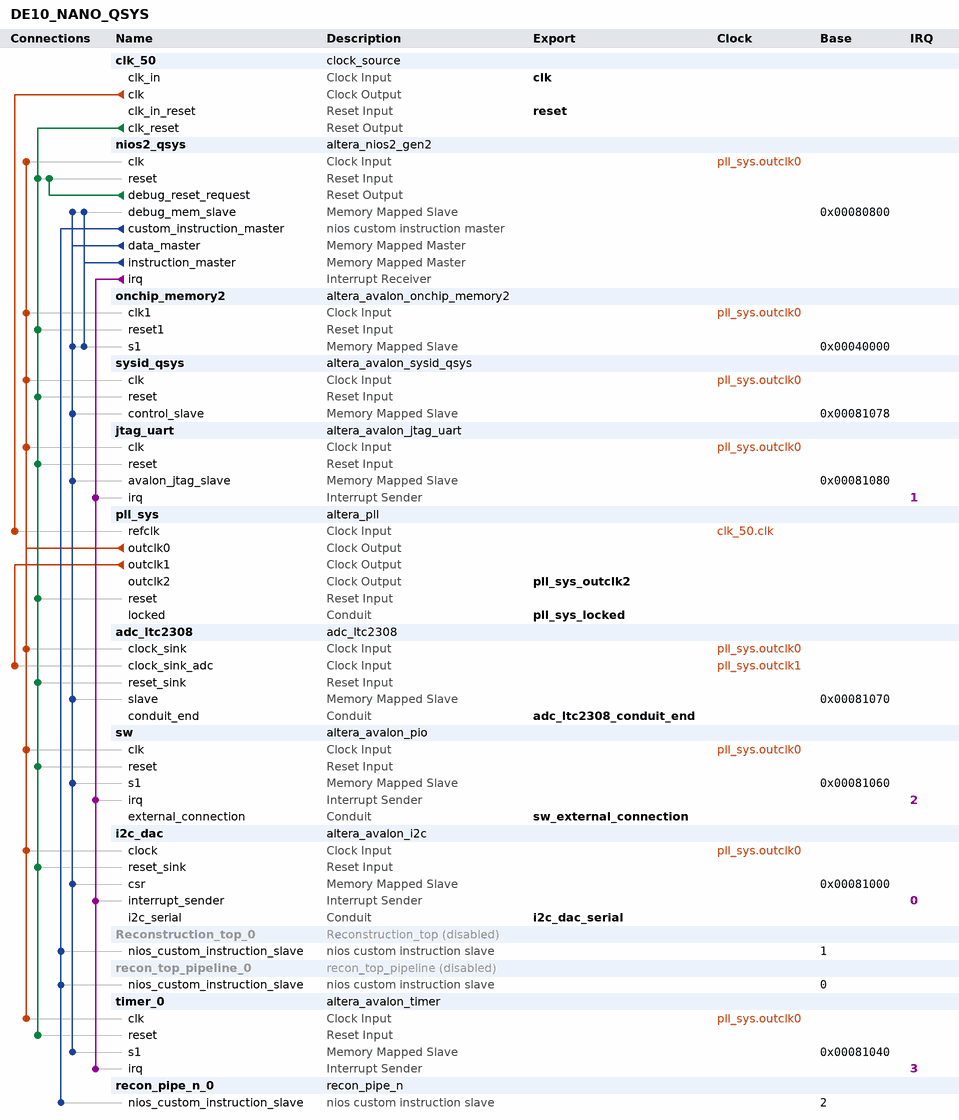
[diagram p0: system contents]
# Platform Designer (Qsys) system DE10_NANO_QSYS, Cyclone V 5CSEBA6U23I7
# Parameters at their usual value, and those the tool derives, are not listed.
package require -exact qsys 18.1
create_system DE10_NANO_QSYS
set_project_property DEVICE_FAMILY {Cyclone V}
set_project_property DEVICE 5CSEBA6U23I7

add_instance clk_50 clock_source 18.1
set_instance_parameter_value clk_50 clockFrequency 50000000

add_instance nios2_qsys altera_nios2_gen2 18.1
set_instance_parameter_value nios2_qsys dcache_size 2048
set_instance_parameter_value nios2_qsys exceptionSlave onchip_memory2.s1
set_instance_parameter_value nios2_qsys icache_size 4096
set_instance_parameter_value nios2_qsys impl Fast
set_instance_parameter_value nios2_qsys resetSlave onchip_memory2.s1
set_instance_parameter_value nios2_qsys setting_activateTrace true

add_instance onchip_memory2 altera_avalon_onchip_memory2 18.1
set_instance_parameter_value onchip_memory2 dataWidth 32
set_instance_parameter_value onchip_memory2 dualPort false
set_instance_parameter_value onchip_memory2 initMemContent true
set_instance_parameter_value onchip_memory2 initializationFileName onchip_mem.hex
set_instance_parameter_value onchip_memory2 memorySize 160000

add_instance sysid_qsys altera_avalon_sysid_qsys 18.1
set_instance_parameter_value sysid_qsys id 0

add_instance jtag_uart altera_avalon_jtag_uart 18.1
set_instance_parameter_value jtag_uart simInteractiveOptions NO_INTERACTIVE_WINDOWS

add_instance pll_sys altera_pll 18.1
set_instance_parameter_value pll_sys gui_device_speed_grade 2
set_instance_parameter_value pll_sys gui_number_of_clocks 3
set_instance_parameter_value pll_sys gui_operation_mode normal
set_instance_parameter_value pll_sys gui_output_clock_frequency0 100.0
set_instance_parameter_value pll_sys gui_output_clock_frequency1 40.0
set_instance_parameter_value pll_sys gui_output_clock_frequency2 200.0
set_instance_parameter_value pll_sys gui_pll_mode {Integer-N PLL}
set_instance_parameter_value pll_sys gui_reference_clock_frequency 50.0
set_instance_parameter_value pll_sys gui_use_locked true

add_instance adc_ltc2308 adc_ltc2308 1.1

add_instance sw altera_avalon_pio 18.1
set_instance_parameter_value sw captureEdge true
set_instance_parameter_value sw direction Input
set_instance_parameter_value sw edgeType ANY
set_instance_parameter_value sw generateIRQ true
set_instance_parameter_value sw irqType EDGE
set_instance_parameter_value sw width 10

add_instance i2c_dac altera_avalon_i2c 18.1
set_instance_parameter_value i2c_dac FIFO_DEPTH 8

add_instance Reconstruction_top_0 Reconstruction_top 1.0
set_instance_property Reconstruction_top_0 ENABLED false
set_instance_parameter_value Reconstruction_top_0 FRACTIONAL_BITS 16
set_instance_parameter_value Reconstruction_top_0 LAMBDA 49152
set_instance_parameter_value Reconstruction_top_0 WIDTH 24
set_instance_parameter_value Reconstruction_top_0 WINDOW_SIZE 100
set_instance_parameter_value Reconstruction_top_0 pipe_delay 10

add_instance recon_top_pipeline_0 recon_top_pipeline 1.0
set_instance_property recon_top_pipeline_0 ENABLED false
set_instance_parameter_value recon_top_pipeline_0 FRACTIONAL_BITS 16
set_instance_parameter_value recon_top_pipeline_0 LAMBDA 49152
set_instance_parameter_value recon_top_pipeline_0 WIDTH 24
set_instance_parameter_value recon_top_pipeline_0 WINDOW_SIZE 100

add_instance timer_0 altera_avalon_timer 18.1
set_instance_parameter_value timer_0 period 1
set_instance_parameter_value timer_0 periodUnits MSEC

add_instance recon_pipe_n_0 recon_pipe_n 1.0
set_instance_parameter_value recon_pipe_n_0 FRACTIONAL_BITS 16
set_instance_parameter_value recon_pipe_n_0 LAMBDA 65536
set_instance_parameter_value recon_pipe_n_0 WIDTH 24
set_instance_parameter_value recon_pipe_n_0 WINDOW_SIZE 100
set_instance_parameter_value recon_pipe_n_0 one_over_a 5041

# connections
add_connection clk_50.clk pll_sys.refclk clock
add_connection pll_sys.outclk0 adc_ltc2308.clock_sink clock
add_connection pll_sys.outclk0 i2c_dac.clock clock
add_connection pll_sys.outclk0 jtag_uart.clk clock
add_connection pll_sys.outclk0 nios2_qsys.clk clock
add_connection pll_sys.outclk0 onchip_memory2.clk1 clock
add_connection pll_sys.outclk0 sw.clk clock
add_connection pll_sys.outclk0 sysid_qsys.clk clock
add_connection pll_sys.outclk0 timer_0.clk clock
add_connection pll_sys.outclk1 adc_ltc2308.clock_sink_adc clock
add_connection clk_50.clk_reset adc_ltc2308.reset_sink reset
add_connection clk_50.clk_reset i2c_dac.reset_sink reset
add_connection clk_50.clk_reset jtag_uart.reset reset
add_connection clk_50.clk_reset nios2_qsys.reset reset
add_connection clk_50.clk_reset onchip_memory2.reset1 reset
add_connection clk_50.clk_reset pll_sys.reset reset
add_connection clk_50.clk_reset sw.reset reset
add_connection clk_50.clk_reset sysid_qsys.reset reset
add_connection clk_50.clk_reset timer_0.reset reset
add_connection nios2_qsys.debug_reset_request nios2_qsys.reset reset
add_connection nios2_qsys.data_master adc_ltc2308.slave avalon
set_connection_parameter_value nios2_qsys.data_master/adc_ltc2308.slave baseAddress 0x00081070
add_connection nios2_qsys.data_master i2c_dac.csr avalon
set_connection_parameter_value nios2_qsys.data_master/i2c_dac.csr baseAddress 0x00081000
add_connection nios2_qsys.data_master jtag_uart.avalon_jtag_slave avalon
set_connection_parameter_value nios2_qsys.data_master/jtag_uart.avalon_jtag_slave baseAddress 0x00081080
add_connection nios2_qsys.data_master nios2_qsys.debug_mem_slave avalon
set_connection_parameter_value nios2_qsys.data_master/nios2_qsys.debug_mem_slave baseAddress 0x00080800
add_connection nios2_qsys.data_master onchip_memory2.s1 avalon
set_connection_parameter_value nios2_qsys.data_master/onchip_memory2.s1 baseAddress 0x00040000
add_connection nios2_qsys.data_master sw.s1 avalon
set_connection_parameter_value nios2_qsys.data_master/sw.s1 baseAddress 0x00081060
add_connection nios2_qsys.data_master sysid_qsys.control_slave avalon
set_connection_parameter_value nios2_qsys.data_master/sysid_qsys.control_slave baseAddress 0x00081078
add_connection nios2_qsys.data_master timer_0.s1 avalon
set_connection_parameter_value nios2_qsys.data_master/timer_0.s1 baseAddress 0x00081040
add_connection nios2_qsys.instruction_master nios2_qsys.debug_mem_slave avalon
set_connection_parameter_value nios2_qsys.instruction_master/nios2_qsys.debug_mem_slave baseAddress 0x00080800
add_connection nios2_qsys.instruction_master onchip_memory2.s1 avalon
set_connection_parameter_value nios2_qsys.instruction_master/onchip_memory2.s1 baseAddress 0x00040000
add_connection nios2_qsys.irq i2c_dac.interrupt_sender interrupt
set_connection_parameter_value nios2_qsys.irq/i2c_dac.interrupt_sender irqNumber 0
add_connection nios2_qsys.irq jtag_uart.irq interrupt
set_connection_parameter_value nios2_qsys.irq/jtag_uart.irq irqNumber 1
add_connection nios2_qsys.irq sw.irq interrupt
set_connection_parameter_value nios2_qsys.irq/sw.irq irqNumber 2
add_connection nios2_qsys.irq timer_0.irq interrupt
set_connection_parameter_value nios2_qsys.irq/timer_0.irq irqNumber 3
add_connection nios2_qsys.custom_instruction_master recon_pipe_n_0.nios_custom_instruction_slave nios_custom_instruction
set_connection_parameter_value nios2_qsys.custom_instruction_master/recon_pipe_n_0.nios_custom_instruction_slave CIName recon_pipe_n_0
set_connection_parameter_value nios2_qsys.custom_instruction_master/recon_pipe_n_0.nios_custom_instruction_slave baseAddress 2
add_connection nios2_qsys.custom_instruction_master recon_top_pipeline_0.nios_custom_instruction_slave nios_custom_instruction
set_connection_parameter_value nios2_qsys.custom_instruction_master/recon_top_pipeline_0.nios_custom_instruction_slave CIName recon_top_pipeline_0
set_connection_parameter_value nios2_qsys.custom_instruction_master/recon_top_pipeline_0.nios_custom_instruction_slave baseAddress 0
add_connection nios2_qsys.custom_instruction_master Reconstruction_top_0.nios_custom_instruction_slave nios_custom_instruction
set_connection_parameter_value nios2_qsys.custom_instruction_master/Reconstruction_top_0.nios_custom_instruction_slave CIName reconstruction_top_0
set_connection_parameter_value nios2_qsys.custom_instruction_master/Reconstruction_top_0.nios_custom_instruction_slave baseAddress 1

# exported interfaces
add_interface adc_ltc2308_conduit_end conduit end
set_interface_property adc_ltc2308_conduit_end EXPORT_OF adc_ltc2308.conduit_end
add_interface clk clock sink
set_interface_property clk EXPORT_OF clk_50.clk_in
add_interface i2c_dac_serial conduit end
set_interface_property i2c_dac_serial EXPORT_OF i2c_dac.i2c_serial
add_interface pll_sys_locked conduit end
set_interface_property pll_sys_locked EXPORT_OF pll_sys.locked
add_interface pll_sys_outclk2 clock source
set_interface_property pll_sys_outclk2 EXPORT_OF pll_sys.outclk2
add_interface reset reset sink
set_interface_property reset EXPORT_OF clk_50.clk_in_reset
add_interface sw_external_connection conduit end
set_interface_property sw_external_connection EXPORT_OF sw.external_connection

set_interconnect_requirement {$system} qsys_mm.clockCrossingAdapter HANDSHAKE
set_interconnect_requirement {$system} qsys_mm.maxAdditionalLatency 1

save_system DE10_NANO_QSYS.qsys
